# Altium schematic sheet esp32.SchDoc
size A4; SheetNumber: 9; SheetTotal: 13
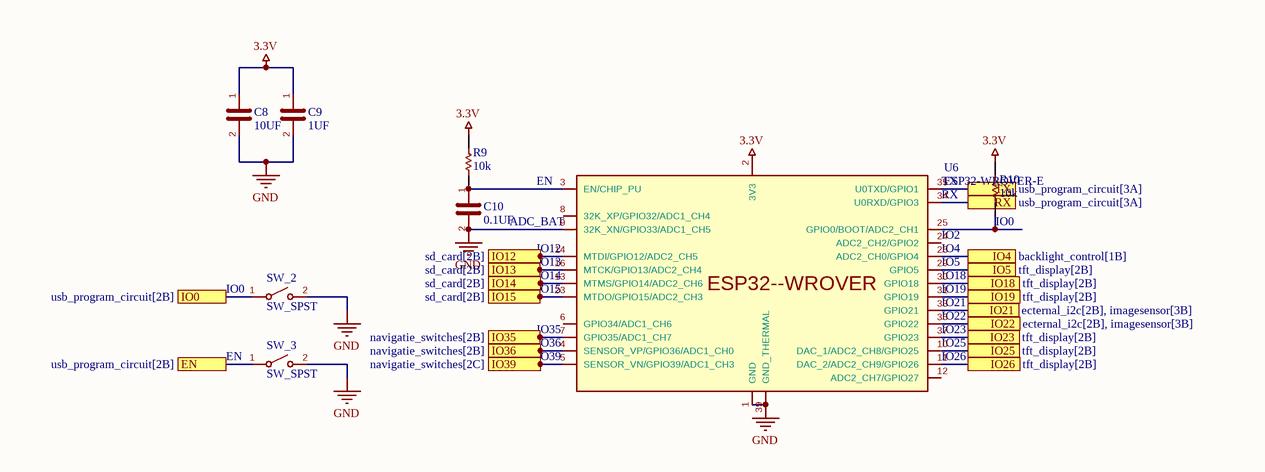
[diagram p0: esp32.SchDoc]

## Parts
C8  10UF  [CAPC2013X70X45NL10T25]
C9  1UF  [CAPC2013X70X45NL10T25]
C10  0.1UF  [CAPC2013X70X45NL10T25]
R9  10k  [RESC2013X70X40NL20T20]
R10  10k  [RESC2013X70X40NL20T20]
SW_2  SW_SPST  [SW_TS09-63-25-WT-160-SMT-TR]
SW_3  SW_SPST  [SW_TS09-63-25-WT-160-SMT-TR]
U6  ESP32-WROVER-E  [FP-ESP32-WROVER-I-MFG]

## Ports
EN (see usb_program_circuit[2B]), IO0 (see usb_program_circuit[2B]), IO4 (see backlight_control[1B]), IO5 (see tft_display[2B]), IO12 (see sd_card[2B]), IO13 (see sd_card[2B]), IO14 (see sd_card[2B]), IO15 (see sd_card[2B]), IO18 (see tft_display[2B]), IO19 (see tft_display[2B]), IO21 (see ecternal_i2c[2B], imagesensor[3B]), IO22 (see ecternal_i2c[2B], imagesensor[3B]), IO23 (see tft_display[2B]), IO25 (see tft_display[2B]), IO26 (see tft_display[2B]), IO35 (see navigatie_switches[2B]), IO36 (see navigatie_switches[2B]), IO39 (see navigatie_switches[2C]), RX (see usb_program_circuit[3A]), TX (see usb_program_circuit[3A])

## Nets
3.3V: C8.1 C9.1 R9.2 R10.2 U6.2(3V3)
GND: C8.2 C9.2 C10.2 SW_2.2(B) SW_3.2(B) U6.1(GND) U6.9(32K_XN/GPIO33/ADC1_CH5) U6.39(GND_THERMAL)
EN: SW_3.1(A) ; port EN
IO0: SW_2.1(A) ; port IO0
IO4: U6.26(ADC2_CH0/GPIO4) ; port IO4
IO5: U6.29(GPIO5) ; port IO5
IO12: U6.14(MTDI/GPIO12/ADC2_CH5) ; port IO12
IO13: U6.16(MTCK/GPIO13/ADC2_CH4) ; port IO13
IO14: U6.13(MTMS/GPIO14/ADC2_CH6) ; port IO14
IO15: U6.23(MTDO/GPIO15/ADC2_CH3) ; port IO15
IO18: U6.30(GPIO18) ; port IO18
IO19: U6.31(GPIO19) ; port IO19
IO21: U6.33(GPIO21) ; port IO21
IO22: U6.36(GPIO22) ; port IO22
IO23: U6.37(GPIO23) ; port IO23
IO25: U6.10(DAC_1/ADC2_CH8/GPIO25) ; port IO25
IO26: U6.11(DAC_2/ADC2_CH9/GPIO26) ; port IO26
IO35: U6.7(GPIO35/ADC1_CH7) ; port IO35
IO36: U6.4(SENSOR_VP/GPIO36/ADC1_CH0) ; port IO36
IO39: U6.5(SENSOR_VN/GPIO39/ADC1_CH3) ; port IO39
RX: U6.34(U0RXD/GPIO3) ; port RX
TX: U6.35(U0TXD/GPIO1) ; port TX
NetC10_1: C10.1 R9.1 U6.3(EN/CHIP_PU)
NetR10_1: R10.1 U6.25(GPIO0/BOOT/ADC2_CH1)

Not connected (* = marked no-connect by the designer): U6 6(GPIO34/ADC1_CH6) 8(32K_XP/GPIO32/ADC1_CH4) 12(ADC2_CH7/GPIO27) 15(GND) 24(ADC2_CH2/GPIO2) 38(GND)

## Notes on the sheet
- ADC_BAT
- (near U6) EN
- (near U6) TX
- (near U6) RX
- (near U6) IO2
- (near R10) IO0
- (near SW_2) IO0
- (near U6) IO12
- (near U6) IO13
- (near U6) IO14
- (near U6) IO15
- (near U6) IO4
- (near U6) IO5
- (near U6) IO18
- (near U6) IO19
- (near U6) IO21
- (near SW_3) EN
- (near U6) IO35
- (near U6) IO36
- (near U6) IO39
- (near U6) IO22
- (near U6) IO23
- (near U6) IO25
- (near U6) IO26
- (in symbol ESP32-WROVER-E) ESP32-­WROVER

## Library data of the parts
C8-C10 = C
R9 R10 = CMP-2100-03671-1: Chip Resistor, 1 KOhm, +/- 1%, 125 mW, -55 to 155 degC, 0805 (2012 Metric), RoHS, Tape and Reel; Manufacturer: Yageo; Temperature Coefficient: 100ppm/degreesC; Voltage Rating (DC): 150V; Max Power Dissipation: 125mW; Resistance: 1KOhm; Number of Pins: 2; Number of Terminations: 2; Datasheet URL: http://www.yageo.com/NewPortal/yageodocoutput?fileName=/pdf/R-Chip/PYu-RC_Group_51_RoHS_L_5.pdf; Length: 0.079inch; Package Description: 2-Pin Surface Mounted Device, Body 2 x 1.25 mm; Depth: 1.25mm; Height: 0.024inch; Military Standard: Not; Case/Package: 0805; Package Reference: 0805; RoHSCompliant: true; Lead Free: LeadFree; Packaging: TapeandReel; Package Quantity: 1; Datasheet Version: Rev. 5, 10/2016; Tolerance: 1%; Min Operating Temperature: -55degC; Voltage Rating: 150V; Composition: ThickFilm; Case Code (Imperial): 0805; Power Rating: 125mW; Width: 0.049inch; Case Code (Metric): 2012; Manufacturer URL: http://www.yageo.com/; Max Operating Temperature: 155degC; REACH SVHC: Unknown; Termination: SMD/SMT